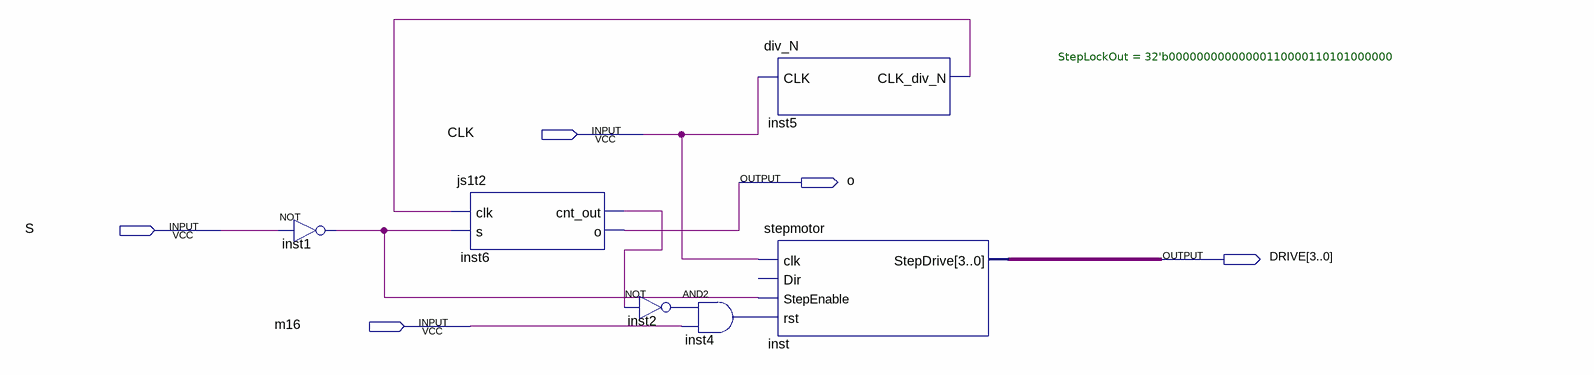
[diagram p0: schematic sheet]
// Quartus schematic 1t2.bdf as structural Verilog: 6 symbols, 5 pins
module \1t2  (
  input  CLK,
  input  S,
  input  m16,
  output o,
  output [3:0] DRIVE
);

  wire inst1_out, inst2_out, inst4_out, inst5_clk_div_n, inst6_cnt_out;

  not inst1 (inst1_out, S);
  js1t2 inst6 (.clk(inst5_clk_div_n), .s(inst1_out), .cnt_out(inst6_cnt_out), .o(o));
  not inst2 (inst2_out, inst6_cnt_out);
  and inst4 (inst4_out, inst2_out, m16);
  div_N inst5 (.CLK(CLK), .CLK_div_N(inst5_clk_div_n));
  stepmotor #(.StepLockOut(32'b00000000000000110000110101000000)) inst (
    .clk(CLK), .StepEnable(inst1_out), .rst(inst4_out), .StepDrive(DRIVE));  // open: Dir
endmodule
